# EAGLE design usb_disc (EAGLE 4.16)
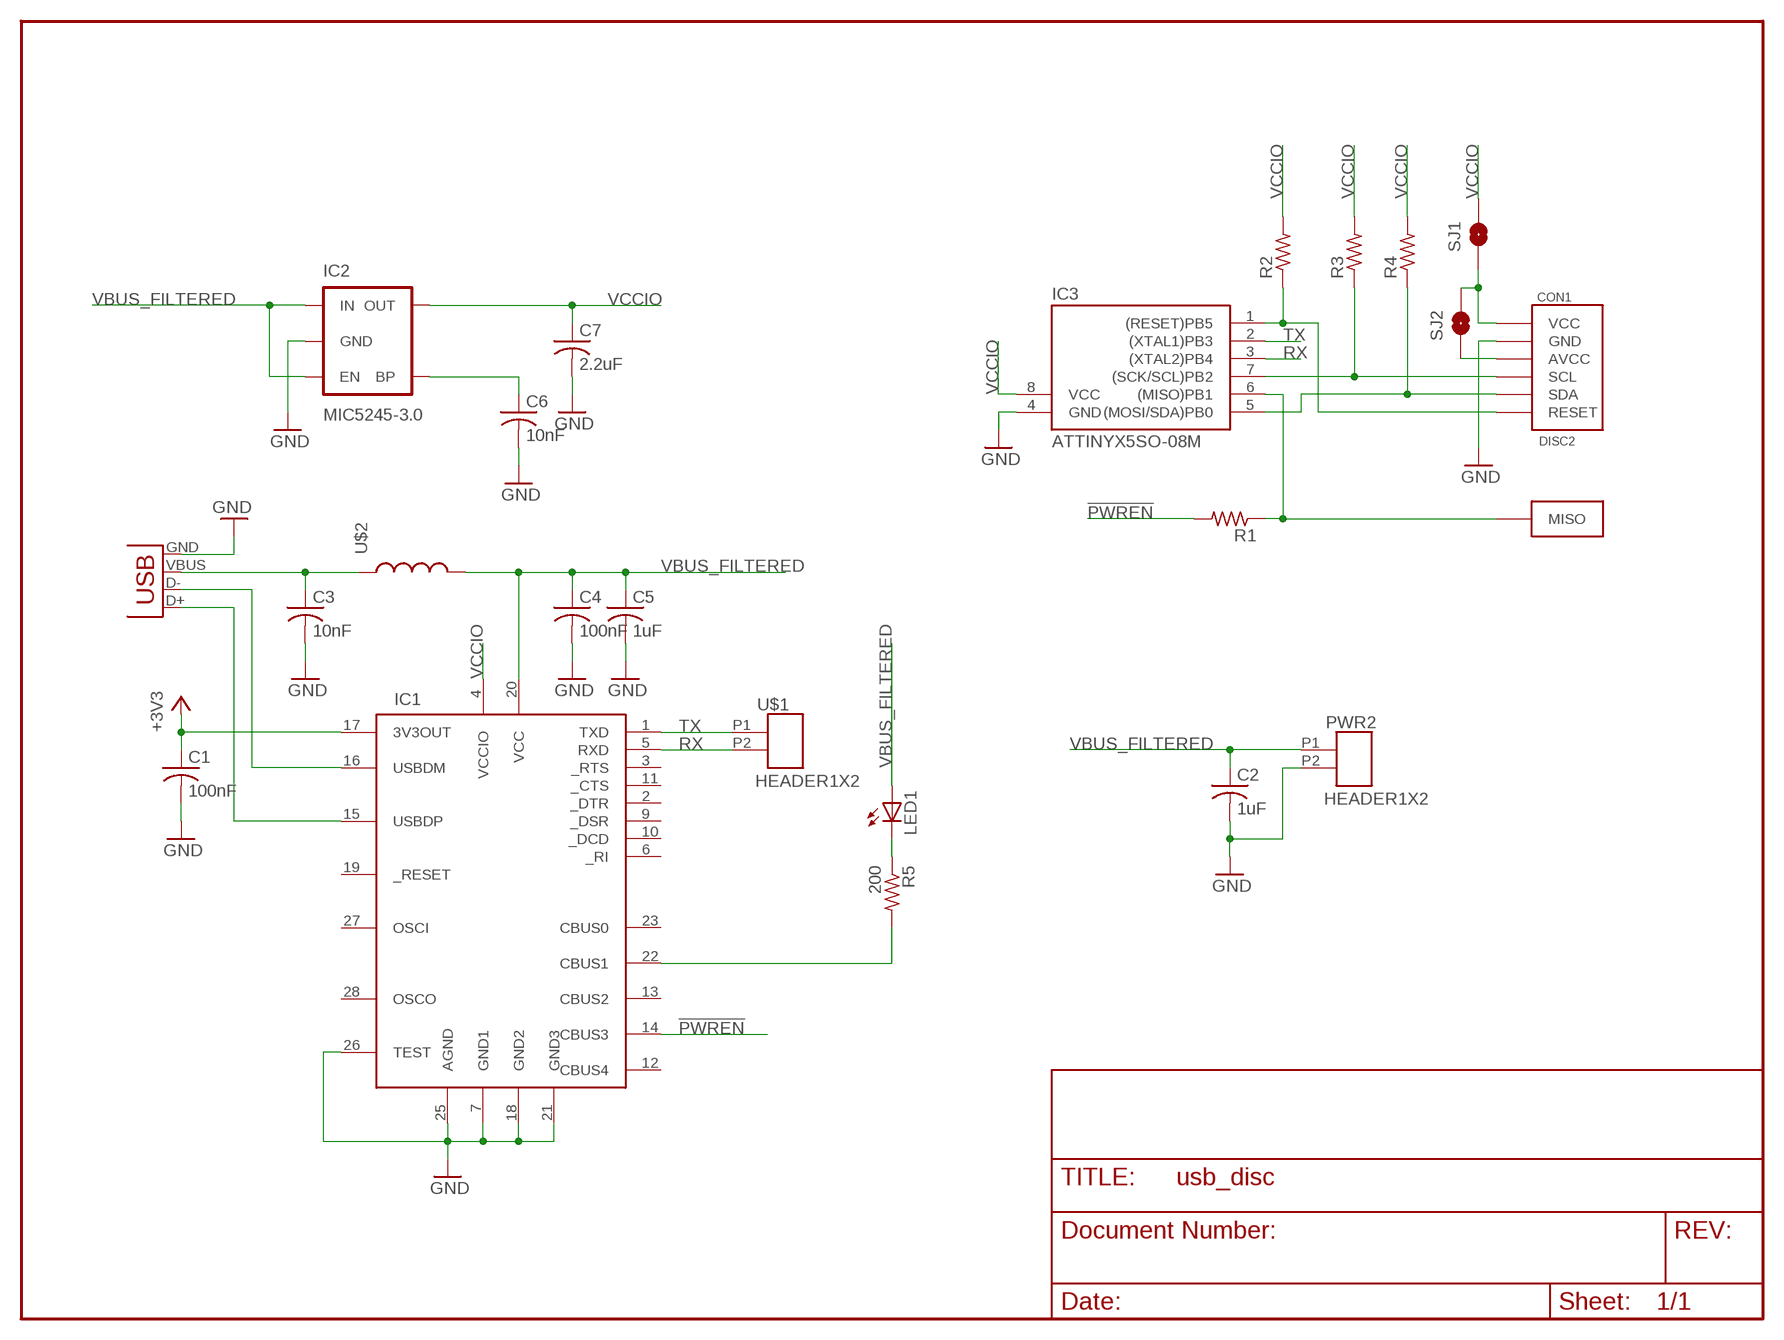
[diagram p0: schematic, sheet 1]

## Parts
C1  100nF  C-USC0805  [C0805]
C2  1uF  C-USC0805  [C0805]
C3  10nF  C-USC0805  [C0805]
C4  100nF  C-USC0805  [C0805]
C5  1uF  C-USC0805  [C0805]
C6  10nF  C-USC0805  [C0805]
C7  2.2uF  C-USC0805  [C0805]
CON1  DISC2  [DISC2]
IC1  FT232RL  [SSOP28DB]
IC2  MIC5245-3.0  V_REG_LDOSMD  [SOT23-5]
IC3  ATTINYX5SO-08M  [SO-08M]
LED1  LEDCHIP-LED0603  [CHIP-LED0603]
PWR2  HEADER1X2  [HEADER1X2]
R1  R-US_R0603  [R0603]
R2  R-US_R0603  [R0603]
R3  R-US_R0603  [R0603]
R4  R-US_R0603  [R0603]
R5  200  R-US_R0603  [R0603]
SJ1  SOLDERJUMPERNO  [SJ-NO]
SJ2  SOLDERJUMPERNO  [SJ-NO]
U$1  HEADER1X2  [HEADER1X2]
U$2  INDUCTOR0603  [0603]
U$4  AVR_ISP_MISO  [AVR_ISP_MISO]
USB1  USBMINIB  [USB-MINIB]

## Nets
!PWREN: IC1.14(CBUS3) R1.2
+3V3: C1.1 IC1.17(3V3OUT)
GND: C1.2 C2.2 C3.2 C4.2 C5.2 C6.2 C7.2 CON1.GND IC1.7(GND1) IC1.18(GND2) IC1.21(GND3) IC1.25(AGND) IC1.26(TEST) IC2.2(GND) IC3.4(GND) PWR2.P2 USB1.GND
MISO: IC3.6((MISO)PB1) R1.1 U$4.MISO
N$1: IC1.16(USBDM) USB1.D-
N$2: IC1.15(USBDP) USB1.D+
N$3: C6.1 IC2.4(BP)
N$4: LED1.C R5.1
N$5: IC1.22(CBUS1) R5.2
N$7: CON1.AVCC SJ2.1
N$11: CON1.RESET IC3.1((RESET)PB5) R2.1
N$12: CON1.SCL IC3.7((SCK/SCL)PB2) R3.1
N$13: CON1.SDA IC3.5((MOSI/SDA)PB0) R4.1
RX: IC1.5(RXD) IC3.3((XTAL2)PB4) U$1.P2
TX: IC1.1(TXD) IC3.2((XTAL1)PB3) U$1.P1
VBUS: C3.1 U$2.1 USB1.VBUS
VBUS_FILTERED: C2.1 C4.1 C5.1 IC1.20(VCC) IC2.1(IN) IC2.3(EN) LED1.A PWR2.P1 U$2.2
VCC: CON1.VCC SJ1.1 SJ2.2
VCCIO: C7.1 IC1.4(VCCIO) IC2.5(OUT) IC3.8(VCC) R2.2 R3.2 R4.2 SJ1.2
Unconnected: IC1.2(_DTR) IC1.3(_RTS) IC1.6(_RI) IC1.9(_DSR) IC1.10(_DCD) IC1.11(_CTS) IC1.12(CBUS4) IC1.13(CBUS2) IC1.19(_RESET) IC1.23(CBUS0) IC1.27(OSCI) IC1.28(OSCO)

## Library data of the parts
C1-C7 = rcl:C-US: CAPACITOR, American symbol
CON1 = anton:DISC2
IC1 = SparkFunEagle-6-6-07:FT232RL: USB UART FT232RL 4th Generation USB UART (USB <-> Serial) Controller. Spark Fun Electronics SKU : COM-00650
IC2 = SparkFunEagle-6-6-07:V_REG_LDO: Voltage Regulator LDO Standard 150mA LDO voltage regulator in SOT-23 layout. Micrel part MIC5205. BP (by-pass) pin is used to lower output noise with 470pF cap.
IC3 = mike:ATTINYX5
LED1 = led:LED: LED OSRAM: - CHIPLED LG R971, LG N971, LY N971, LG Q971, LY Q971, LO R971, LY R971 LH N974, LH R974 LS Q976, LO Q976, LY Q976 LO Q996 - Hyper CHIPLED LW Q18S LB Q993, LB Q99A, LB R99A - SideLED LS A670, LO A670, LY A670, LG A670, LP A670 LB A673, LV A673, LT A673, LW A673 LH A674 LY A675 LS A676, LA A676, LO A676, LY A676, LW A676 LS A679, LY A679, LG A679 - Hyper Micro SIDELED® LS Y876, LA Y876, LO Y876, LY Y876 LT Y87S - SmartLED LW L88C, LW L88S LB L89C, LB L89S, LG L890 LS L89K, LO L89K, LY L89K LS L896, LA L896, LO L896, LY L896 - TOPLED LS T670, LO T670, LY T670, LG T670, LP T670 LSG T670, LSP T670, LSY T670, LOP T670, LYG T670 LG T671, LOG T671, LSG T671 LB T673, LV T673, LT T673, LW T673 LH T674 LS T676, LA T676, LO T676, LY T676, LB T676, LH T676, LSB T676, LW T676 LB T67C, LV T67C, LT T67C, LS T67K, LO T67K, LY T67K, LW E67C LS E67B, LA E67B, LO E67B, LY E67B, LB E67C, LV E67C, LT E67C LW T67C LS T679, LY T679, LG T679 LS T770, LO T770, LY T770, LG T770, LP T770 LB T773, LV T773, LT T773, LW T773 LH T774 LS E675, LA E675, LY E675, LS T675 LS T776, LA T776, LO T776, LY T776, LB T776 LHGB T686 LT T68C, LB T68C - Hyper Mini TOPLED® LB M676 - Mini TOPLED Santana® LG M470 LS M47K, LO M47K, LY M47K Source: http://www.osram.convergy.de - LUMILED® LXK2-PW12-R00, LXK2-PW12-S00, LXK2-PW14-U00, LXK2-PW14-V00 LXK2-PM12-R00, LXK2-PM12-S00, LXK2-PM14-U00 LXK2-PE12-Q00, LXK2-PE12-R00, LXK2-PE12-S00, LXK2-PE14-T00, LXK2-PE14-U00 LXK2-PB12-K00, LXK2-PB12-L00, LXK2-PB12-M00, LXK2-PB14-N00, LXK2-PB14-P00, LXK2-PB14-Q00 LXK2-PR12-L00, LXK2-PR12-M00, LXK2-PR14-Q00, LXK2-PR14-R00 LXK2-PD12-Q00, LXK2-PD12-R00, LXK2-PD12-S00 LXK2-PH12-R00, LXK2-PH12-S00 LXK2-PL12-P00, LXK2-PL12-Q00, LXK2-PL12-R00 Source: www.luxeon.com
PWR2 U$1 = anton:HEADER1X2
R1-R5 = rcl:R-US_: RESISTOR, American symbol
SJ1 SJ2 = SparkFunEagle-6-6-07:SOLDERJUMPER: Solder Jumper Standard SMD solder jumper. Used to automate production. Two varients : Normally Open and Normally Closed are the same, but have different paste layers. NC will have a large amount of paste and should jumper during reflow.
U$2 = SparkFunEagle-6-6-07:INDUCTOR: Inductors Basic Inductor/Choke - 0603 and 1206. Footprints are not proven and vary greatly between part numbers.
U$4 = anton:AVR_ISP_MISO
USB1 = SparkFunEagle-6-6-07:USB: USB Connectors USB-B-PTH is fully proven SKU : PRT-00139 USB-miniB is fully proven SKU : PRT-00587 USB-A-H is throughly reviewed, but untested. Spark Fun Electronics SKU : PRT-00437 USB-B-SMT is throughly reviewed, but untested. Needs silkscreen touching up. USB-A-S has not been used/tested USB-MB-H has not been used/tested

## Board
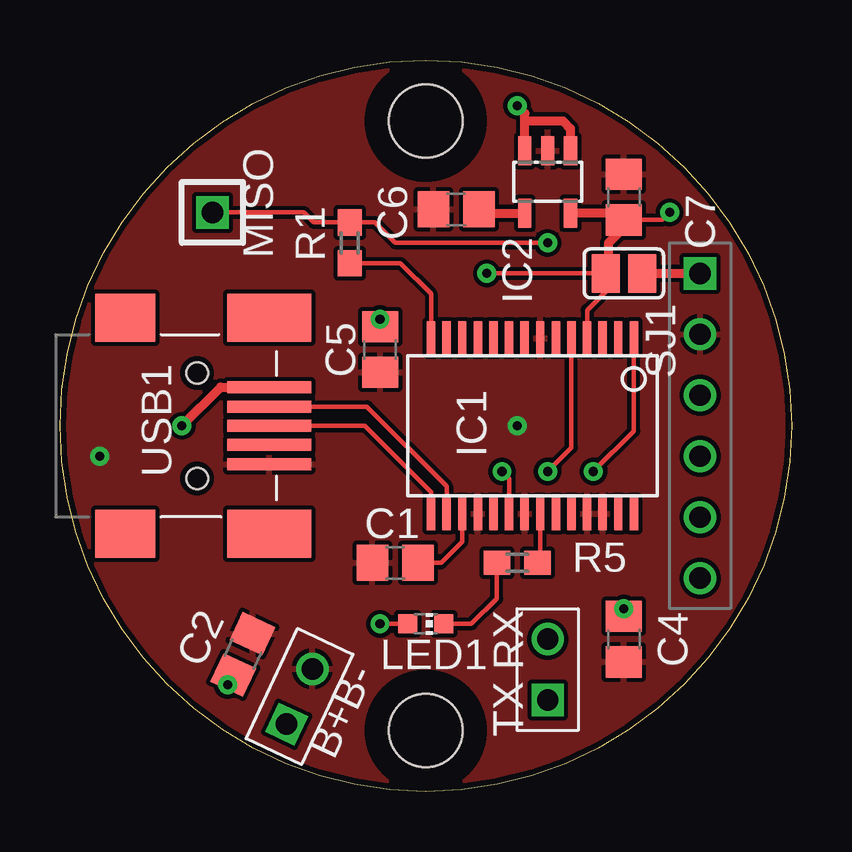
[diagram p1: board, top side]
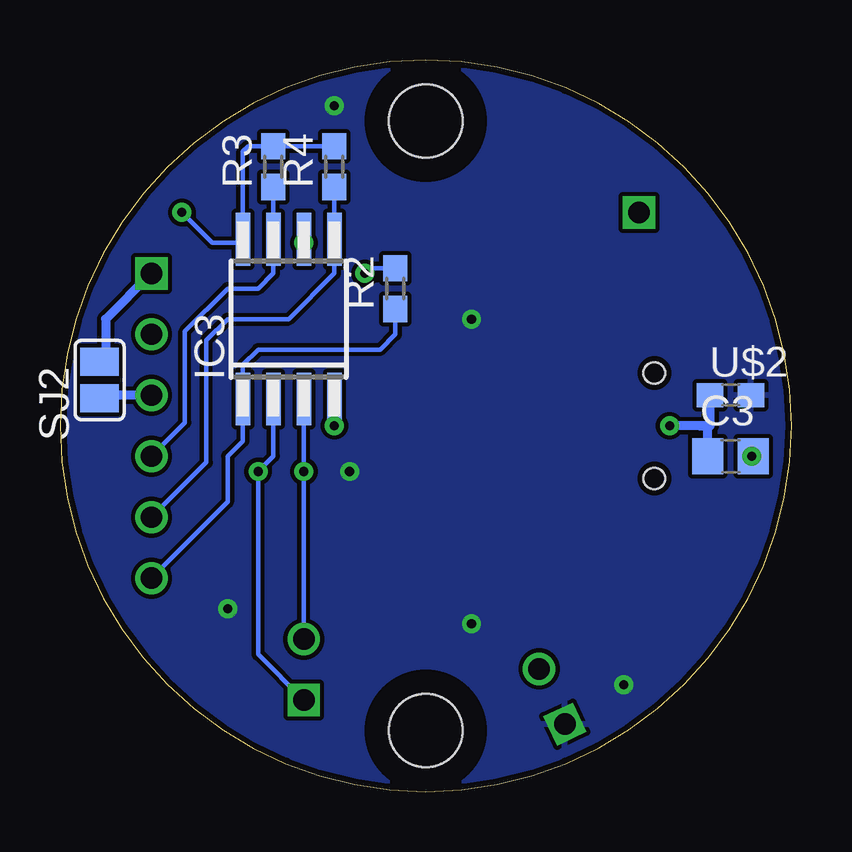
[diagram p2: board, bottom side, seen from below]

Size 30.48 x 30.48 mm. Coordinates in mm from the lower left corner, seen from the top.
Copper layers (1*16): Top 0.035mm / dielectric 1.5mm / Bottom 0.035mm
Design rules "AdvancedCircuts": minimum track width 7mil, minimum drill 15mil, track to track 7mil, track to pad 7mil, pad to pad 7mil, via to via 7mil, smd to smd 0mil, copper to edge 10mil, drill to drill 8mil, minimum pad ring 9mil, minimum via ring 8mil, stop-mask expansion 4mil, vias tented up to drill 0mil, thermal gap 7mil

### Footprints (pad centres in the part's own frame; a part is rotated, then mirrored left to right if it is on the bottom)
C0805 = smd 1.3 x 1.5: 1 -0.95,0; 2 0.95,0
DISC2 = drill 0.889 round: AVCC 11.43,1.27; GND 11.43,3.81; RESET 11.43,-6.35; SCL 11.43,-1.27; SDA 11.43,-3.81 | drill 0.889 square: VCC 11.43,6.35 | hole 3.048: 0,-12.7; 0,12.7
SSOP28DB = smd 0.348 x 1.397: 1 -4.225,-3.656; 2 -3.575,-3.656; 3 -2.925,-3.656; 4 -2.275,-3.656; 5 -1.625,-3.656; 6 -0.975,-3.656; 7 -0.325,-3.656; 8 0.325,-3.656; 9 0.975,-3.656; 10 1.625,-3.656; 11 2.275,-3.656; 12 2.925,-3.656; 13 3.575,-3.656; 14 4.225,-3.656; 15 4.225,3.656; 16 3.575,3.656; 17 2.925,3.656; 18 2.275,3.656; 19 1.625,3.656; 20 0.975,3.656; 21 0.325,3.656; 22 -0.325,3.656; 23 -0.975,3.656; 24 -1.625,3.656; 25 -2.275,3.656; 26 -2.925,3.656; 27 -3.575,3.656; 28 -4.225,3.656
SOT23-5 = smd 0.55 x 1.2: 1 -0.95,-1.3; 2 0,-1.3; 3 0.95,-1.3; 4 0.95,1.3; 5 -0.95,1.3
SO-08M = smd 0.6 x 2.2: 1 -1.905,-3.33; 2 -0.635,-3.33; 3 0.635,-3.33; 4 1.905,-3.33; 5 1.905,3.33; 6 0.635,3.33; 7 -0.635,3.33; 8 -1.905,3.33
CHIP-LED0603 = smd 0.8 x 0.8: A 0,-0.75; C 0,0.75
HEADER1X2 = drill 0.889 square: P1 0,1.27 | drill 0.889 round: P2 0,-1.27
R0603 = smd 1.1 x 1: 1 -0.85,0; 2 0.85,0
SJ-NO = smd 1.168 x 1.6: 1 -0.762,0; 2 0.762,0
0603 = smd 1.1 x 1: 1 -0.85,0; 2 0.85,0
AVR_ISP_MISO = drill 0.889 square: MISO 0,0
USB-MINIB = smd 2.5 x 2: 1 -3,-4.5; 2 -3,4.5 | smd 3.5 x 2: 3 3,-4.5; 4 3,4.5 | smd 3.5 x 0.5: D+ 3,0; D- 3,0.8; GND 3,-1.6; ID 3,-0.8; VBUS 3.01,1.61 | hole 0.889: 0,2.2; 0,-2.2

### Placement (x,y rotation side)
C1  [C0805]  13.97,9.52 180 top
C2  [C0805]  7.62,5.71 65 top
C3  [C0805]  2.54,13.97 0 bottom
C4  [C0805]  23.5,6.35 270 top
C5  [C0805]  13.34,18.41 270 top
C6  [C0805]  16.51,24.26 180 top
C7  [C0805]  23.5,24.76 90 top
CON1  15.24,15.24 0 top
IC1  19.69,15.24 180 top
IC2  V_REG_LDOSMD  [SOT23-5]  20.32,25.4 180 top
IC3  20.95,19.68 0 bottom
LED1  15.24,6.98 270 top
PWR2  9.98,3.96 155 top
R1  12.07,22.86 270 top
R2  16.51,20.95 90 bottom
R3  21.59,26.04 90 bottom
R4  19.05,26.04 90 bottom
R5  [R0603]  19.05,9.52 0 top
SJ1  23.5,21.59 180 top
SJ2  28.83,17.14 90 bottom
U$1  20.32,5.08 180 top
U$2  2.54,16.51 0 bottom
U$4  6.35,24.13 0 top
USB1  5.72,15.24 0 top

### Tracks (layer width: path | path; a pad name or v marks a point on that pad's centre or on a via)
!PWREN
  Top 0.178: IC1.14 15.46,20.73 14.19,22.01 R1.2
+3V3
  Top 0.178: IC1.17 16.76,10.41 15.88,9.52 C1.1 14.61,9.52
GND  (via drill 0.38)
  Bottom 0.178: IC3.4 v19.05,15.24 | C3.2 v1.65,13.97
  pour Top: 15.24,30.48 arc-90 30.48,15.24 arc-90 15.24,0 arc-90 0,15.24 arc-90
MISO  (via drill 0.38)
  Top 0.178: U$4.MISO 10.16,24.13 10.58,23.71 R1.1 13.12,23.71 13.97,22.86 v20.32,22.86
  Bottom 0.178: v20.32,22.86 IC3.6
N$1
  Top 0.178: USB1.D- 12.79,16.04 16.11,12.72 IC1.16
N$2
  Top 0.178: USB1.D+ 12.7,15.24 15.46,12.48 IC1.15
N$3
  Top 0.381: C6.1 17.27,24.26 17.15,24.13 17.18,24.1 IC2.4
N$4
  Top 0.178: R5.1 18.2,8.04 17.15,6.98 LED1.C 15.88,6.98
N$5
  Top 0.178: R5.2 19.69,9.52 20.01,9.85 IC1.22
N$7
  Bottom 0.381: SJ2.1 28.7,16.38 28.58,16.51 CON1.AVCC
N$11
  Bottom 0.178: CON1.RESET 23.5,12.07 23.5,13.97 22.86,14.61 IC3.1 22.86,17.78 22.23,18.41 17.15,18.41 16.51,19.05 R2.1 16.51,20.32
N$12
  Bottom 0.178: CON1.SCL 25.27,15.37 25.27,19.18 23.5,20.95 22.23,20.95 21.59,21.59 IC3.7 R3.1 21.59,25.4
N$13
  Bottom 0.178: CON1.SDA 24.38,13.72 24.38,18.8 23.5,19.68 20.95,19.68 19.05,21.59 IC3.5 R4.1 19.05,25.4
RX  (via drill 0.38)
  Top 0.178: IC1.5 21.31,14.32 v20.32,13.34
  Bottom 0.178: U$1.P2 v20.32,13.34 IC3.3
TX  (via drill 0.38)
  Top 0.178: IC1.1 23.91,15.02 v22.23,13.34
  Bottom 0.178: U$1.P1 22.23,5.71 v22.23,13.34 21.59,13.97 IC3.2
VBUS  (via drill 0.38)
  Top 0.381: USB1.VBUS 6.69,16.85 v5.08,15.24
  Bottom 0.381: 3.18,16.51 U$2.1 3.39,15.24 3.81,15.24 | C3.1 3.49,15.24 3.81,15.24 | 3.81,15.24 v5.08,15.24
VBUS_FILTERED  (via drill 0.38)
  Top 0.178: C5.1 v13.34,19.68 | IC1.20 18.71,13.04 v18.41,13.34 | C4.1 v23.5,7.62 | LED1.A v13.34,6.98 | C2.1 7.22,4.68 v6.99,4.45
  Top 0.381: IC2.3 19.37,27.94 | 19.37,27.94 19.37,28.25 v19.05,28.57 | IC2.1 21.27,27.62 20.95,27.94 19.37,27.94
  pour Bottom: 15.24,30.48 arc-90 30.48,15.24 arc-90 15.24,0 arc-90 0,15.24 arc-90
VCC
  Top 0.381: SJ1.1 CON1.VCC
  Bottom 0.381: CON1.VCC 28.58,19.68 28.58,17.78 28.7,17.91 SJ2.2
VCCIO  (via drill 0.38)
  Top 0.178: IC1.4 21.96,20.05 22.73,20.83 SJ1.2 | v17.78,21.59 22.86,21.59 | C7.1 25.09,23.82 v25.4,24.13
  Top 0.381: SJ1.2 22.86,21.59 22.86,22.86 23.5,23.5 C7.1 23.5,24.13 23.47,24.1 IC2.5
  Bottom 0.178: R2.2 17.57,21.8 v17.78,21.59 | v25.4,24.13 24.13,22.86 22.86,22.86 | R4.2 21.38,26.89 21.59,26.67 R3.2 22.65,26.89 22.86,26.67 22.86,22.86 | 22.86,22.86 IC3.8

### Text on the board
tNames: MISO | TX RX | B+B-